# Altium schematic sheet 17_FPGA_decoupling.SchDoc: FPGA Decoupling
size A3; Organization: Lime Microsystems; Address1: Surrey Tech Centre; Address2: Guildford GU2 7YG; Address3: Surrey; Address4: United Kingdom; Revision: v1.2; SheetNumber: 15; SheetTotal: 27
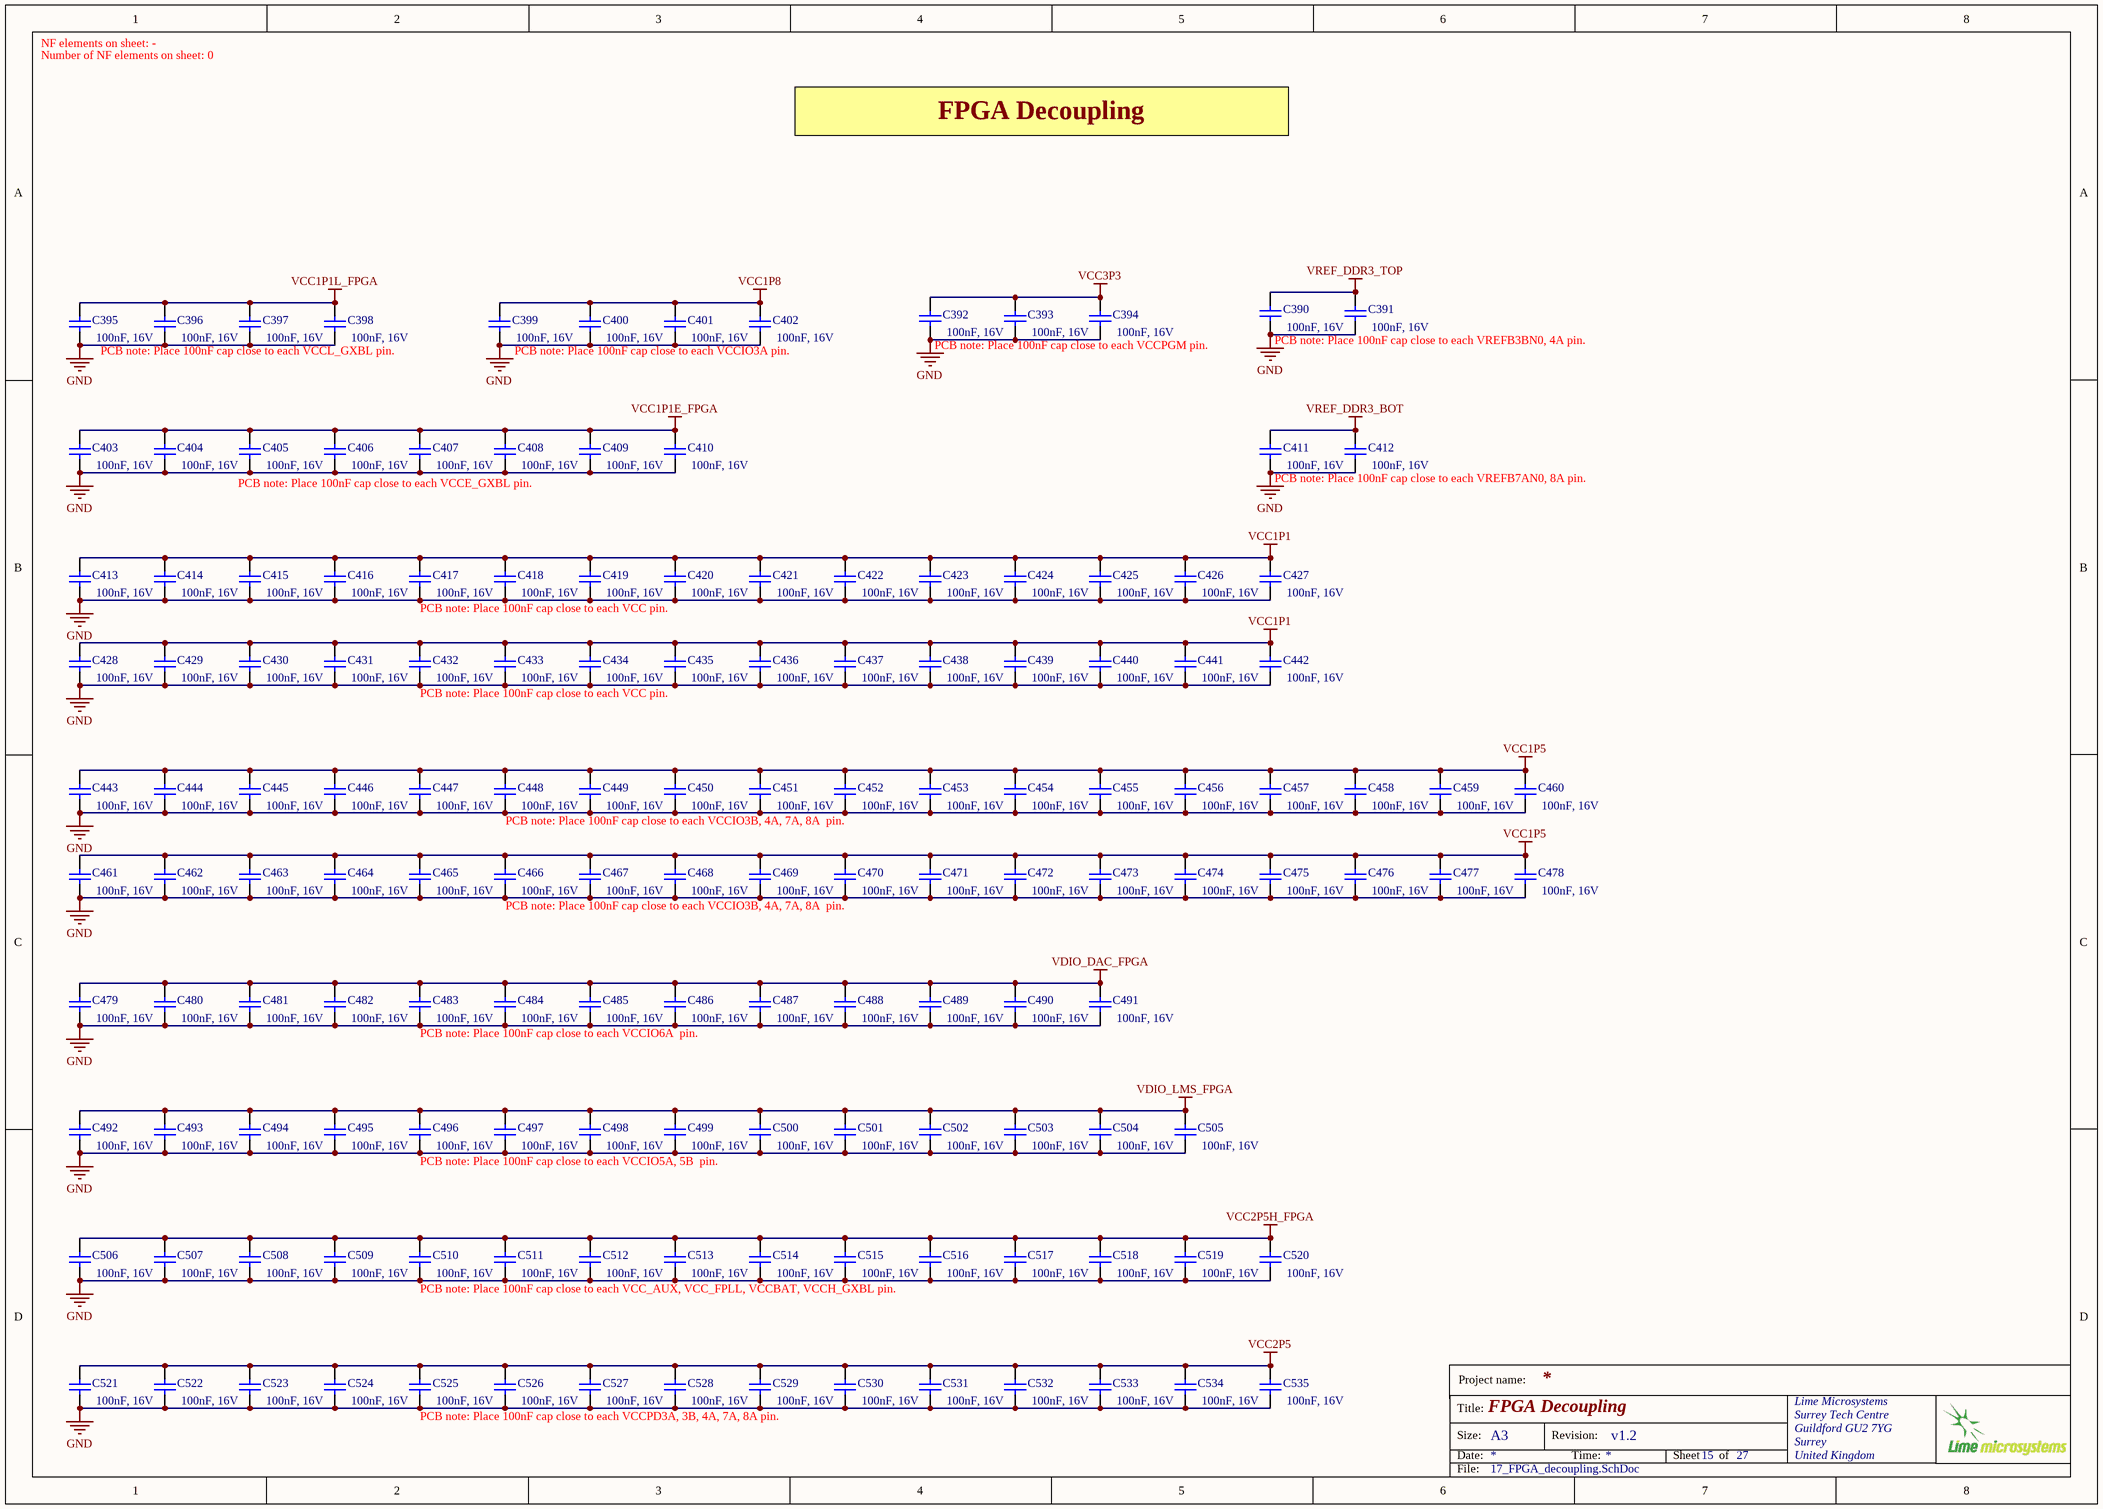
[diagram p0: 17_FPGA_decoupling.SchDoc]

## Parts
C390  100nF, 16V  [CAP0402]
C391  100nF, 16V  [CAP0402]
C392  100nF, 16V  [CAP0402]
C393  100nF, 16V  [CAP0402]
C394  100nF, 16V  [CAP0402]
C395  100nF, 16V  [CAP0402]
C396  100nF, 16V  [CAP0402]
C397  100nF, 16V  [CAP0402]
C398  100nF, 16V  [CAP0402]
C399  100nF, 16V  [CAP0402]
C400  100nF, 16V  [CAP0402]
C401  100nF, 16V  [CAP0402]
C402  100nF, 16V  [CAP0402]
C403  100nF, 16V  [CAP0402]
C404  100nF, 16V  [CAP0402]
C405  100nF, 16V  [CAP0402]
C406  100nF, 16V  [CAP0402]
C407  100nF, 16V  [CAP0402]
C408  100nF, 16V  [CAP0402]
C409  100nF, 16V  [CAP0402]
C410  100nF, 16V  [CAP0402]
C411  100nF, 16V  [CAP0402]
C412  100nF, 16V  [CAP0402]
C413  100nF, 16V  [CAP0402]
C414  100nF, 16V  [CAP0402]
C415  100nF, 16V  [CAP0402]
C416  100nF, 16V  [CAP0402]
C417  100nF, 16V  [CAP0402]
C418  100nF, 16V  [CAP0402]
C419  100nF, 16V  [CAP0402]
C420  100nF, 16V  [CAP0402]
C421  100nF, 16V  [CAP0402]
C422  100nF, 16V  [CAP0402]
C423  100nF, 16V  [CAP0402]
C424  100nF, 16V  [CAP0402]
C425  100nF, 16V  [CAP0402]
C426  100nF, 16V  [CAP0402]
C427  100nF, 16V  [CAP0402]
C428  100nF, 16V  [CAP0402]
C429  100nF, 16V  [CAP0402]
C430  100nF, 16V  [CAP0402]
C431  100nF, 16V  [CAP0402]
C432  100nF, 16V  [CAP0402]
C433  100nF, 16V  [CAP0402]
C434  100nF, 16V  [CAP0402]
C435  100nF, 16V  [CAP0402]
C436  100nF, 16V  [CAP0402]
C437  100nF, 16V  [CAP0402]
C438  100nF, 16V  [CAP0402]
C439  100nF, 16V  [CAP0402]
C440  100nF, 16V  [CAP0402]
C441  100nF, 16V  [CAP0402]
C442  100nF, 16V  [CAP0402]
C443  100nF, 16V  [CAP0402]
C444  100nF, 16V  [CAP0402]
C445  100nF, 16V  [CAP0402]
C446  100nF, 16V  [CAP0402]
C447  100nF, 16V  [CAP0402]
C448  100nF, 16V  [CAP0402]
C449  100nF, 16V  [CAP0402]
C450  100nF, 16V  [CAP0402]
C451  100nF, 16V  [CAP0402]
C452  100nF, 16V  [CAP0402]
C453  100nF, 16V  [CAP0402]
C454  100nF, 16V  [CAP0402]
C455  100nF, 16V  [CAP0402]
C456  100nF, 16V  [CAP0402]
C457  100nF, 16V  [CAP0402]
C458  100nF, 16V  [CAP0402]
C459  100nF, 16V  [CAP0402]
C460  100nF, 16V  [CAP0402]
C461  100nF, 16V  [CAP0402]
C462  100nF, 16V  [CAP0402]
C463  100nF, 16V  [CAP0402]
C464  100nF, 16V  [CAP0402]
C465  100nF, 16V  [CAP0402]
C466  100nF, 16V  [CAP0402]
C467  100nF, 16V  [CAP0402]
C468  100nF, 16V  [CAP0402]
C469  100nF, 16V  [CAP0402]
C470  100nF, 16V  [CAP0402]
C471  100nF, 16V  [CAP0402]
C472  100nF, 16V  [CAP0402]
C473  100nF, 16V  [CAP0402]
C474  100nF, 16V  [CAP0402]
C475  100nF, 16V  [CAP0402]
C476  100nF, 16V  [CAP0402]
C477  100nF, 16V  [CAP0402]
C478  100nF, 16V  [CAP0402]
C479  100nF, 16V  [CAP0402]
C480  100nF, 16V  [CAP0402]
C481  100nF, 16V  [CAP0402]
C482  100nF, 16V  [CAP0402]
C483  100nF, 16V  [CAP0402]
C484  100nF, 16V  [CAP0402]
C485  100nF, 16V  [CAP0402]
C486  100nF, 16V  [CAP0402]
C487  100nF, 16V  [CAP0402]
C488  100nF, 16V  [CAP0402]
C489  100nF, 16V  [CAP0402]
C490  100nF, 16V  [CAP0402]
C491  100nF, 16V  [CAP0402]
C492  100nF, 16V  [CAP0402]
C493  100nF, 16V  [CAP0402]
C494  100nF, 16V  [CAP0402]
C495  100nF, 16V  [CAP0402]
C496  100nF, 16V  [CAP0402]
C497  100nF, 16V  [CAP0402]
C498  100nF, 16V  [CAP0402]
C499  100nF, 16V  [CAP0402]
C500  100nF, 16V  [CAP0402]
C501  100nF, 16V  [CAP0402]
C502  100nF, 16V  [CAP0402]
C503  100nF, 16V  [CAP0402]
C504  100nF, 16V  [CAP0402]
C505  100nF, 16V  [CAP0402]
C506  100nF, 16V  [CAP0402]
C507  100nF, 16V  [CAP0402]
C508  100nF, 16V  [CAP0402]
C509  100nF, 16V  [CAP0402]
C510  100nF, 16V  [CAP0402]
C511  100nF, 16V  [CAP0402]
C512  100nF, 16V  [CAP0402]
C513  100nF, 16V  [CAP0402]
C514  100nF, 16V  [CAP0402]
C515  100nF, 16V  [CAP0402]
C516  100nF, 16V  [CAP0402]
C517  100nF, 16V  [CAP0402]
C518  100nF, 16V  [CAP0402]
C519  100nF, 16V  [CAP0402]
C520  100nF, 16V  [CAP0402]
C521  100nF, 16V  [CAP0402]
C522  100nF, 16V  [CAP0402]
C523  100nF, 16V  [CAP0402]
C524  100nF, 16V  [CAP0402]
C525  100nF, 16V  [CAP0402]
C526  100nF, 16V  [CAP0402]
C527  100nF, 16V  [CAP0402]
C528  100nF, 16V  [CAP0402]
C529  100nF, 16V  [CAP0402]
C530  100nF, 16V  [CAP0402]
C531  100nF, 16V  [CAP0402]
C532  100nF, 16V  [CAP0402]
C533  100nF, 16V  [CAP0402]
C534  100nF, 16V  [CAP0402]
C535  100nF, 16V  [CAP0402]

## Nets
GND: C390.2 C391.2 C392.2 C393.2 C394.2 C395.2 C396.2 C397.2 C398.2 C399.2 C400.2 C401.2 C402.2 C403.2 C404.2 C405.2 C406.2 C407.2 C408.2 C409.2 C410.2 C411.2 C412.2 C413.2 C414.2 C415.2 C416.2 C417.2 C418.2 C419.2 C420.2 C421.2 C422.2 C423.2 C424.2 C425.2 C426.2 C427.2 C428.2 C429.2 C430.2 C431.2 C432.2 C433.2 C434.2 C435.2 C436.2 C437.2 C438.2 C439.2 C440.2 C441.2 C442.2 C443.2 C444.2 C445.2 C446.2 C447.2 C448.2 C449.2 C450.2 C451.2 C452.2 C453.2 C454.2 C455.2 C456.2 C457.2 C458.2 C459.2 C460.2 C461.2 C462.2 C463.2 C464.2 C465.2 C466.2 C467.2 C468.2 C469.2 C470.2 C471.2 C472.2 C473.2 C474.2 C475.2 C476.2 C477.2 C478.2 C479.2 C480.2 C481.2 C482.2 C483.2 C484.2 C485.2 C486.2 C487.2 C488.2 C489.2 C490.2 C491.2 C492.2 C493.2 C494.2 C495.2 C496.2 C497.2 C498.2 C499.2 C500.2 C501.2 C502.2 C503.2 C504.2 C505.2 C506.2 C507.2 C508.2 C509.2 C510.2 C511.2 C512.2 C513.2 C514.2 C515.2 C516.2 C517.2 C518.2 C519.2 C520.2 C521.2 C522.2 C523.2 C524.2 C525.2 C526.2 C527.2 C528.2 C529.2 C530.2 C531.2 C532.2 C533.2 C534.2 C535.2
VCC1P1: C413.1 C414.1 C415.1 C416.1 C417.1 C418.1 C419.1 C420.1 C421.1 C422.1 C423.1 C424.1 C425.1 C426.1 C427.1 C428.1 C429.1 C430.1 C431.1 C432.1 C433.1 C434.1 C435.1 C436.1 C437.1 C438.1 C439.1 C440.1 C441.1 C442.1
VCC1P1E_FPGA: C403.1 C404.1 C405.1 C406.1 C407.1 C408.1 C409.1 C410.1
VCC1P1L_FPGA: C395.1 C396.1 C397.1 C398.1
VCC1P5: C443.1 C444.1 C445.1 C446.1 C447.1 C448.1 C449.1 C450.1 C451.1 C452.1 C453.1 C454.1 C455.1 C456.1 C457.1 C458.1 C459.1 C460.1 C461.1 C462.1 C463.1 C464.1 C465.1 C466.1 C467.1 C468.1 C469.1 C470.1 C471.1 C472.1 C473.1 C474.1 C475.1 C476.1 C477.1 C478.1
VCC1P8: C399.1 C400.1 C401.1 C402.1
VCC2P5: C521.1 C522.1 C523.1 C524.1 C525.1 C526.1 C527.1 C528.1 C529.1 C530.1 C531.1 C532.1 C533.1 C534.1 C535.1
VCC2P5H_FPGA: C506.1 C507.1 C508.1 C509.1 C510.1 C511.1 C512.1 C513.1 C514.1 C515.1 C516.1 C517.1 C518.1 C519.1 C520.1
VCC3P3: C392.1 C393.1 C394.1
VDIO_DAC_FPGA: C479.1 C480.1 C481.1 C482.1 C483.1 C484.1 C485.1 C486.1 C487.1 C488.1 C489.1 C490.1 C491.1
VDIO_LMS_FPGA: C492.1 C493.1 C494.1 C495.1 C496.1 C497.1 C498.1 C499.1 C500.1 C501.1 C502.1 C503.1 C504.1 C505.1
VREF_DDR3_BOT: C411.1 C412.1
VREF_DDR3_TOP: C390.1 C391.1

## Notes on the sheet
- NF elements on sheet: -
- Number of NF elements on sheet: 0
- FPGA Decoupling
- PCB note: Place 100nF cap close to each VCCL_GXBL pin.
- PCB note: Place 100nF cap close to each VCCIO3A pin.
- PCB note: Place 100nF cap close to each VCCPGM pin.
- PCB note: Place 100nF cap close to each VREFB3BN0, 4A pin.
- PCB note: Place 100nF cap close to each VCCE_GXBL pin.
- PCB note: Place 100nF cap close to each VREFB7AN0, 8A pin.
- PCB note: Place 100nF cap close to each VCC pin.
- PCB note: Place 100nF cap close to each VCCIO3B, 4A, 7A, 8A  pin.
- PCB note: Place 100nF cap close to each VCCIO6A  pin.
- PCB note: Place 100nF cap close to each VCCIO5A, 5B  pin.
- PCB note: Place 100nF cap close to each VCC_AUX, VCC_FPLL, VCCBAT, VCCH_GXBL pin.
- PCB note: Place 100nF cap close to each VCCPD3A, 3B, 4A, 7A, 8A pin.
- Project name:
- Title:
- Size:
- Date:
- A3
- Revision:
- Time:
- Sheet
- of
- File:

## Library data of the parts
C390-C535 = Cap_0603: Manufacturer Part Number 1: GRM155R71C104KA88D; Part Description: 0.10µF ±10% 16V Ceramic Capacitor X7R 0402 (1005 Metric); Brand: Murata Electronics; Tolerance: 10 %; Type: General Purpose MLCC; Capacitance: 0.1 uF; Temperature Coefficient / Code: +/- 15 %; Case Height: 0.5 mm; Case Length: 1 mm; Dielectric: X7R; Supplier 1: Mouser; Supplier Part Number 1: 81-GRM155R71C104KA88; Case Code - in: 0402; Manufacturer: Murata Electronics; Category: Multilayer Ceramic Capacitors MLCC - SMD/SMT; Voltage Rating DC: 16 V; Value: 100nF, 16V; Manufacturer Part Number: GRM155R71C104KA88D; Case Code - mm: 1005; Case Width: 0.5 mm; Maximum Operating Temperature: + 125 C; Minimum Operating Temperature: - 55 C; Minimum Order Quantity: 1; Operating Temperature Range: - 55 C to + 125 C; Package / Case: 0402 (1005 metric); Packaging: Reel; Product: General Type MLCCs; Product Category: Low & Medium Capacitance SMD Ceramic Chip Capacitors; Reeling: True; RoHS - Mouser: Y; RoHS: RoHS Compliant; Series: GRM; Standard Pack Qty: 10000; Termination Style: SMD/SMT